# Altium schematic sheet USB_OTG_FS.SchDoc: USB_OTG_FS
size A4; DocumentNumber: MB1246; Revision: B.1; SheetNumber: 9; SheetTotal: 17; Project: STM32H7xxI-EVAL
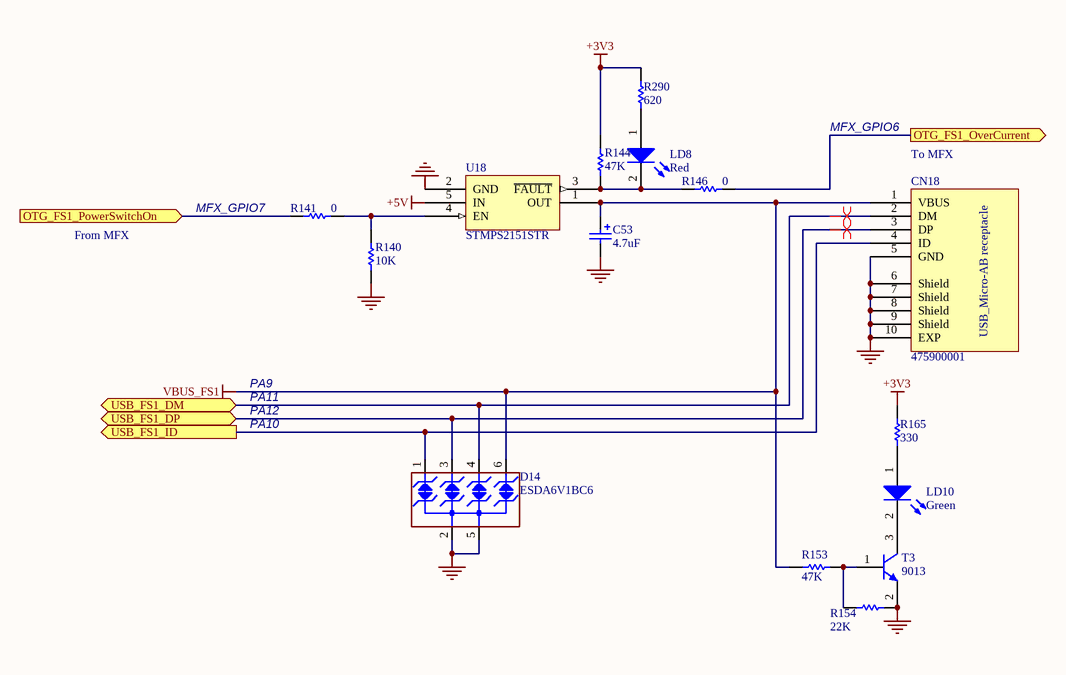
[diagram p0: USB_OTG_FS.SchDoc]

## Parts
C53  4.7uF  [TAN-A]
CN18  475900001  [MOLEX_47590001]
D14  ESDA6V1BC6  [SOT23-6L]
LD8  Red  [0603D]
LD10  Green  [0603D]
R140  10K  [0603R]
R141  0  [0603R]
R144  47K  [0603R]
R146  0  [0603R]
R153  47K  [0603R]
R154  22K  [0603R]
R165  330  [0603R]
R290  620  [0603R]
T3  9013  [SOT-23]
U18  STMPS2151STR  [SOT23-5]

## Ports
OTG_FS1_OverCurrent (out), OTG_FS1_PowerSwitchOn (in), USB_FS1_DM (bidir), USB_FS1_DP (bidir), USB_FS1_ID (out)

## Nets
+3V3: R144.1 R165.2 R290.2
+5V: U18.5(IN)
GND: C53.2 CN18.5(GND) CN18.6(Shield) CN18.7(Shield) CN18.8(Shield) CN18.9(Shield) CN18.10(EXP) D14.2(IO2) D14.5(IO4) R140.1 R154.1 T3.2(E) U18.2(GND)
VBUS_FS1: C53.1 CN18.1(VBUS) D14.6(NC) R153.1 U18.1(OUT)
OTG_FS1_OverCurrent: R146.1 ; port OTG_FS1_OverCurrent
OTG_FS1_PowerSwitchOn: R141.2 ; port OTG_FS1_PowerSwitchOn
USB_FS1_DM: CN18.2(DM) D14.4(IO3) ; port USB_FS1_DM
USB_FS1_DP: CN18.3(DP) D14.3(GND) ; port USB_FS1_DP
USB_FS1_ID: CN18.4(ID) D14.1(IO1) ; port USB_FS1_ID
NetLD8_1: LD8.1(A) R290.1
NetLD8_2: LD8.2(K) R144.2 R146.2 U18.3(~{FAULT})
NetLD10_1: LD10.1(A) R165.1
NetLD10_2: LD10.2(K) T3.3(C)
NetR140_2: R140.2 R141.1 U18.4(EN)
NetR153_2: R153.2 R154.2 T3.1(B)

## Layout directives
differential pair: USB_FS1_DM, USB_FS1_DP

## Notes on the sheet
- MFX_GPIO6
- (near R141) MFX_GPIO7
- (near CN18) To MFX
- From MFX
- PA9
- PA11
- PA12
- PA10
- Title:
- Project:
- Size:
- Date:
- A4
- Reference:
- Sheet:
- Revision:
- of
- (in symbol 475900001) USB_Micro-AB receptacle

## Library data of the parts
C53 = Cap Pol1: Polarized Capacitor (Radial); Value: 47uF; Published: 8-Jun-2000; Revision: July-2002: Re-released for DXP Platform.; Publisher: Altium Limited
D14 = ESDA6V1BC6: 4-line ESD protection; Manuf_1: STM; Manuf_Part_1: ESDA5V3L; Description: Dual Transil array for ESD protection; Ref St: 9179034; Provided: ST; ECCN_US/EU: EAR99/NEC; Distrib: ST; Order: ESDA5V3L; Ordered by: STM
LD8 LD10 = LED2: Typical RED, GREEN, YELLOW, AMBER GaAs LED; Published: 8-Jun-2000; Revision: July-2002: Re-released for DXP Platform.; Publisher: Altium Limited
R140 R141 R146 R290 = Res1: Resistor; Value: 1K; Published: 8-Jun-2000; Revision: July-2002: Re-released for DXP Platform.; Publisher: Altium Limited
R144 R153 R154 R165 = res1: Resistor; Value: 1K; Published: 8-Jun-2000; Revision: July-2002: Re-released for DXP Platform.; Publisher: Altium Limited
T3 = NPN: NPN Bipolar Transistor; Code - JEDEC: TO-226-AA; Published: 8-Jun-2000; Revision: July-2002: Re-released for DXP Platform.; Publisher: Altium Limited
U18 = STMPS2141STR